# Altium project Breakout_6pin.PrjPcb
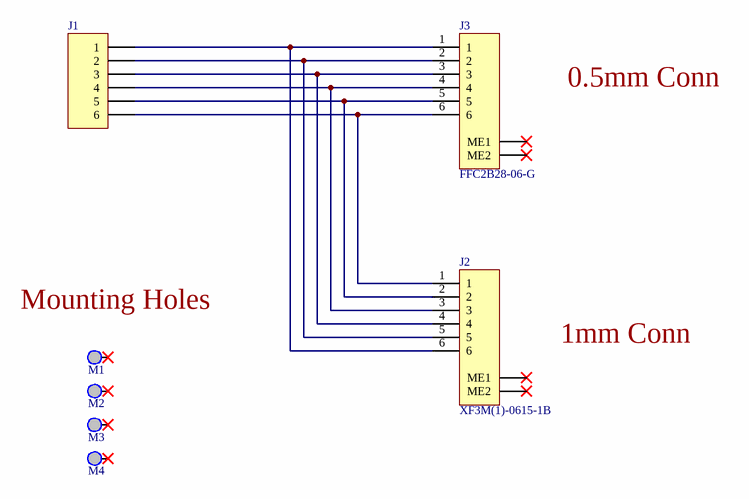
[diagram p0: Main.SchDoc]
ProjectName: Breakout_6pin; Rev: A
1 sheet, 7 parts. Net scope: global (net labels, ports and power ports of the same name join across sheets).
Board file: Breakout_6pin.PcbDoc

## Sheet Main.SchDoc: Breakout 6pin
size A3; Organization: INTERCREATE; Address1: 2415 3RD ST. SUITE #232; Address2: SAN FRANCISCO CA 94107; Revision: A; SheetNumber: 1; SheetTotal: 1; ProjectName: KAGWERKS COMMAND CENTER

### Parts
J1  61300611121  [HDR-V-1X6]  (value not drawn)
J2  XF3M(1)-0615-1B  [CONN-FFC-H-6P-1MM]
J3  FFC2B28-06-G  [CONN-FFC-H-6P-0.5MM]
M1  MTG_HOLE  [MH_P_2.5MM]  (value not drawn)  (no BOM)
M2  MTG_HOLE  [MH_P_2.5MM]  (value not drawn)  (no BOM)
M3  MTG_HOLE  [MH_P_2.5MM]  (value not drawn)  (no BOM)
M4  MTG_HOLE  [MH_P_2.5MM]  (value not drawn)  (no BOM)

### Nets
NetJ1_1: J1.1 J2.6 J3.1
NetJ1_2: J1.2 J2.5 J3.2
NetJ1_3: J1.3 J2.4 J3.3
NetJ1_4: J1.4 J2.3 J3.4
NetJ1_5: J1.5 J2.2 J3.5
NetJ1_6: J1.6 J2.1 J3.6

Not connected (* = marked no-connect by the designer): J2 ME1* ME2*; J3 ME1* ME2*; M1 1*; M2 1*; M3 1*; M4 1*

### Notes on the sheet
- 0.5mm Conn
- (near M1) Mounting Holes
- 1mm Conn
- Title
- Size:
- Date:
- A3
- Number:
- Time:
- Revision:
- Sheet
- of
- File:

### Library data of the parts
J1 = HDR-V-1X6-M: Header, 6-Pin, 0.1"; Manufacturer 1: Wurth Electronics; Current Rating: 3A; Voltage Rating: 250V; Number of Positions: 6; Gender: Male; Connector Type: Male Pin; Pitch: 0.1inch; Supplier 1: Digi-Key; Manufacturer Part Number 1: 61300611121; Stock 1: 13863; Pricing 1: 1=0.33000, 10=0.27900, 25=0.23200, 50=0.19400, 100=0.17600, 1000=0.16000 (USD); RoHS: Yes; Mount: Through Hole; Contact Plating: Gold; Contact Material: Copper Alloy; Housing Material: PBT; Color: Black; Min Operating Temperature: -40°C; Max Operating Temperature: 125°C; Number of Rows: 1; Contact Gender: Male; Packaging: Bulk; Termination: Through Hole; Number of Contacts: 6; Contact Mating Length: 0.236inch; REACH SVHC: Unknown; Lead Free: Lead Free; ComponentLink1URL: http://www.mouser.com/ds/2/445/6130xx11121-538006.pdf?src-supplier=Mouser; ComponentLink1Description: http://www.mouser.com/ds/2/445/6130xx11121-538006.pdf?src-supplier=Mouser; ComponentLink2URL: https://katalog.we-online.de/em/datasheet/6130xx11121.pdf?src-supplier=Digi-Key; ComponentLink2Description: https://katalog.we-online.de/em/datasheet/6130xx11121.pdf?src-supplier=Digi-Key; ComponentLink3URL: http://www.farnell.com/cad/1737268.pdf?src-supplier=Element14; ComponentLink3Description: http://www.farnell.com/cad/1737268.pdf?src-supplier=Element14; Supplier Part Number 1: 732-5319-ND
J2 = CONN-FFC-H-6P-1MM: 1.0-mm Pitch, Dual Contact ; For FPC/FFC, 6 Contacts, RoHS; Manufacturer 1: Omron; Actuator Material: Polymer,Liquid Crystal Polymer; Actuator Color: Black; Number of Positions: 6; Voltage Rating: 50V; Current Rating: 500mA; Mating Cycles: 20; Pitch: 0.039inch; Supplier: Newark; Supplier Part Number: 46Y1126; Manufacturer Part Number 1: XF3M(1)-0615-1B; RoHS: Yes; Category: FFC / FPC; Stock: 212; Pricing: 1=1.22, 10=1.05, 25=0.991, 50=0.958, 100=0.945, 250=0.915, 500=0.86, 1000=0.765 (USD); Mounting Technology: Surface Mount; Contact Material: Copper Alloy; Contact Plating: Gold; Housing Material: Polymer; Housing Color: Natural; Min Operating Temperature: -30°C; Max Operating Temperature: 85°C; Number of Rows: 1; Packaging: Tape and Reel; Termination: Solder; Orientation: Right Angle; Series: XF3M; Package Quantity: 1500; Flammability Rating: UL94 V-0; RoHS Compliant: Yes; ComponentLink1URL: https://datasheet.ciiva.com/48563/en-xf3m-48563813.pdf?src-supplier=Avnet; ComponentLink1Description: https://datasheet.ciiva.com/48563/en-xf3m-48563813.pdf?src-supplier=Avnet
J3 = CONN-FFC-H-6P-0.5MM: 6 Position FFC, FPC Connector Contacts, Top and Bottom 0.020" (0.50mm) Surface Mount, Right Angle; Manufacturer 1: Global Connector Technology; Pitch: 0.5mm; Number of Positions: 6; Manufacturer Part Number 1: FFC2B28-06-G
M1-M4 = MTG_HOLE: MTG HOLE PLATED VARIOUS SIZES

## Assembly variants
Mfg: not fitted J1 J1